# EAGLE schematic PIO-Dev-3 (EAGLE 9.5.2)
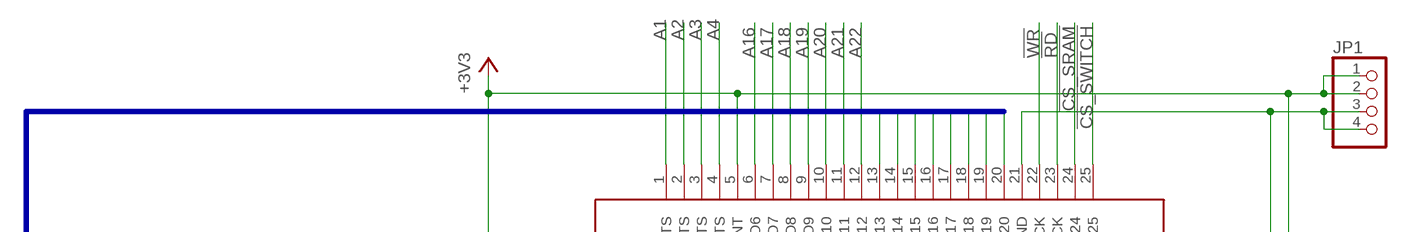
[diagram p0: schematic, sheet 1, part 1 of 3]
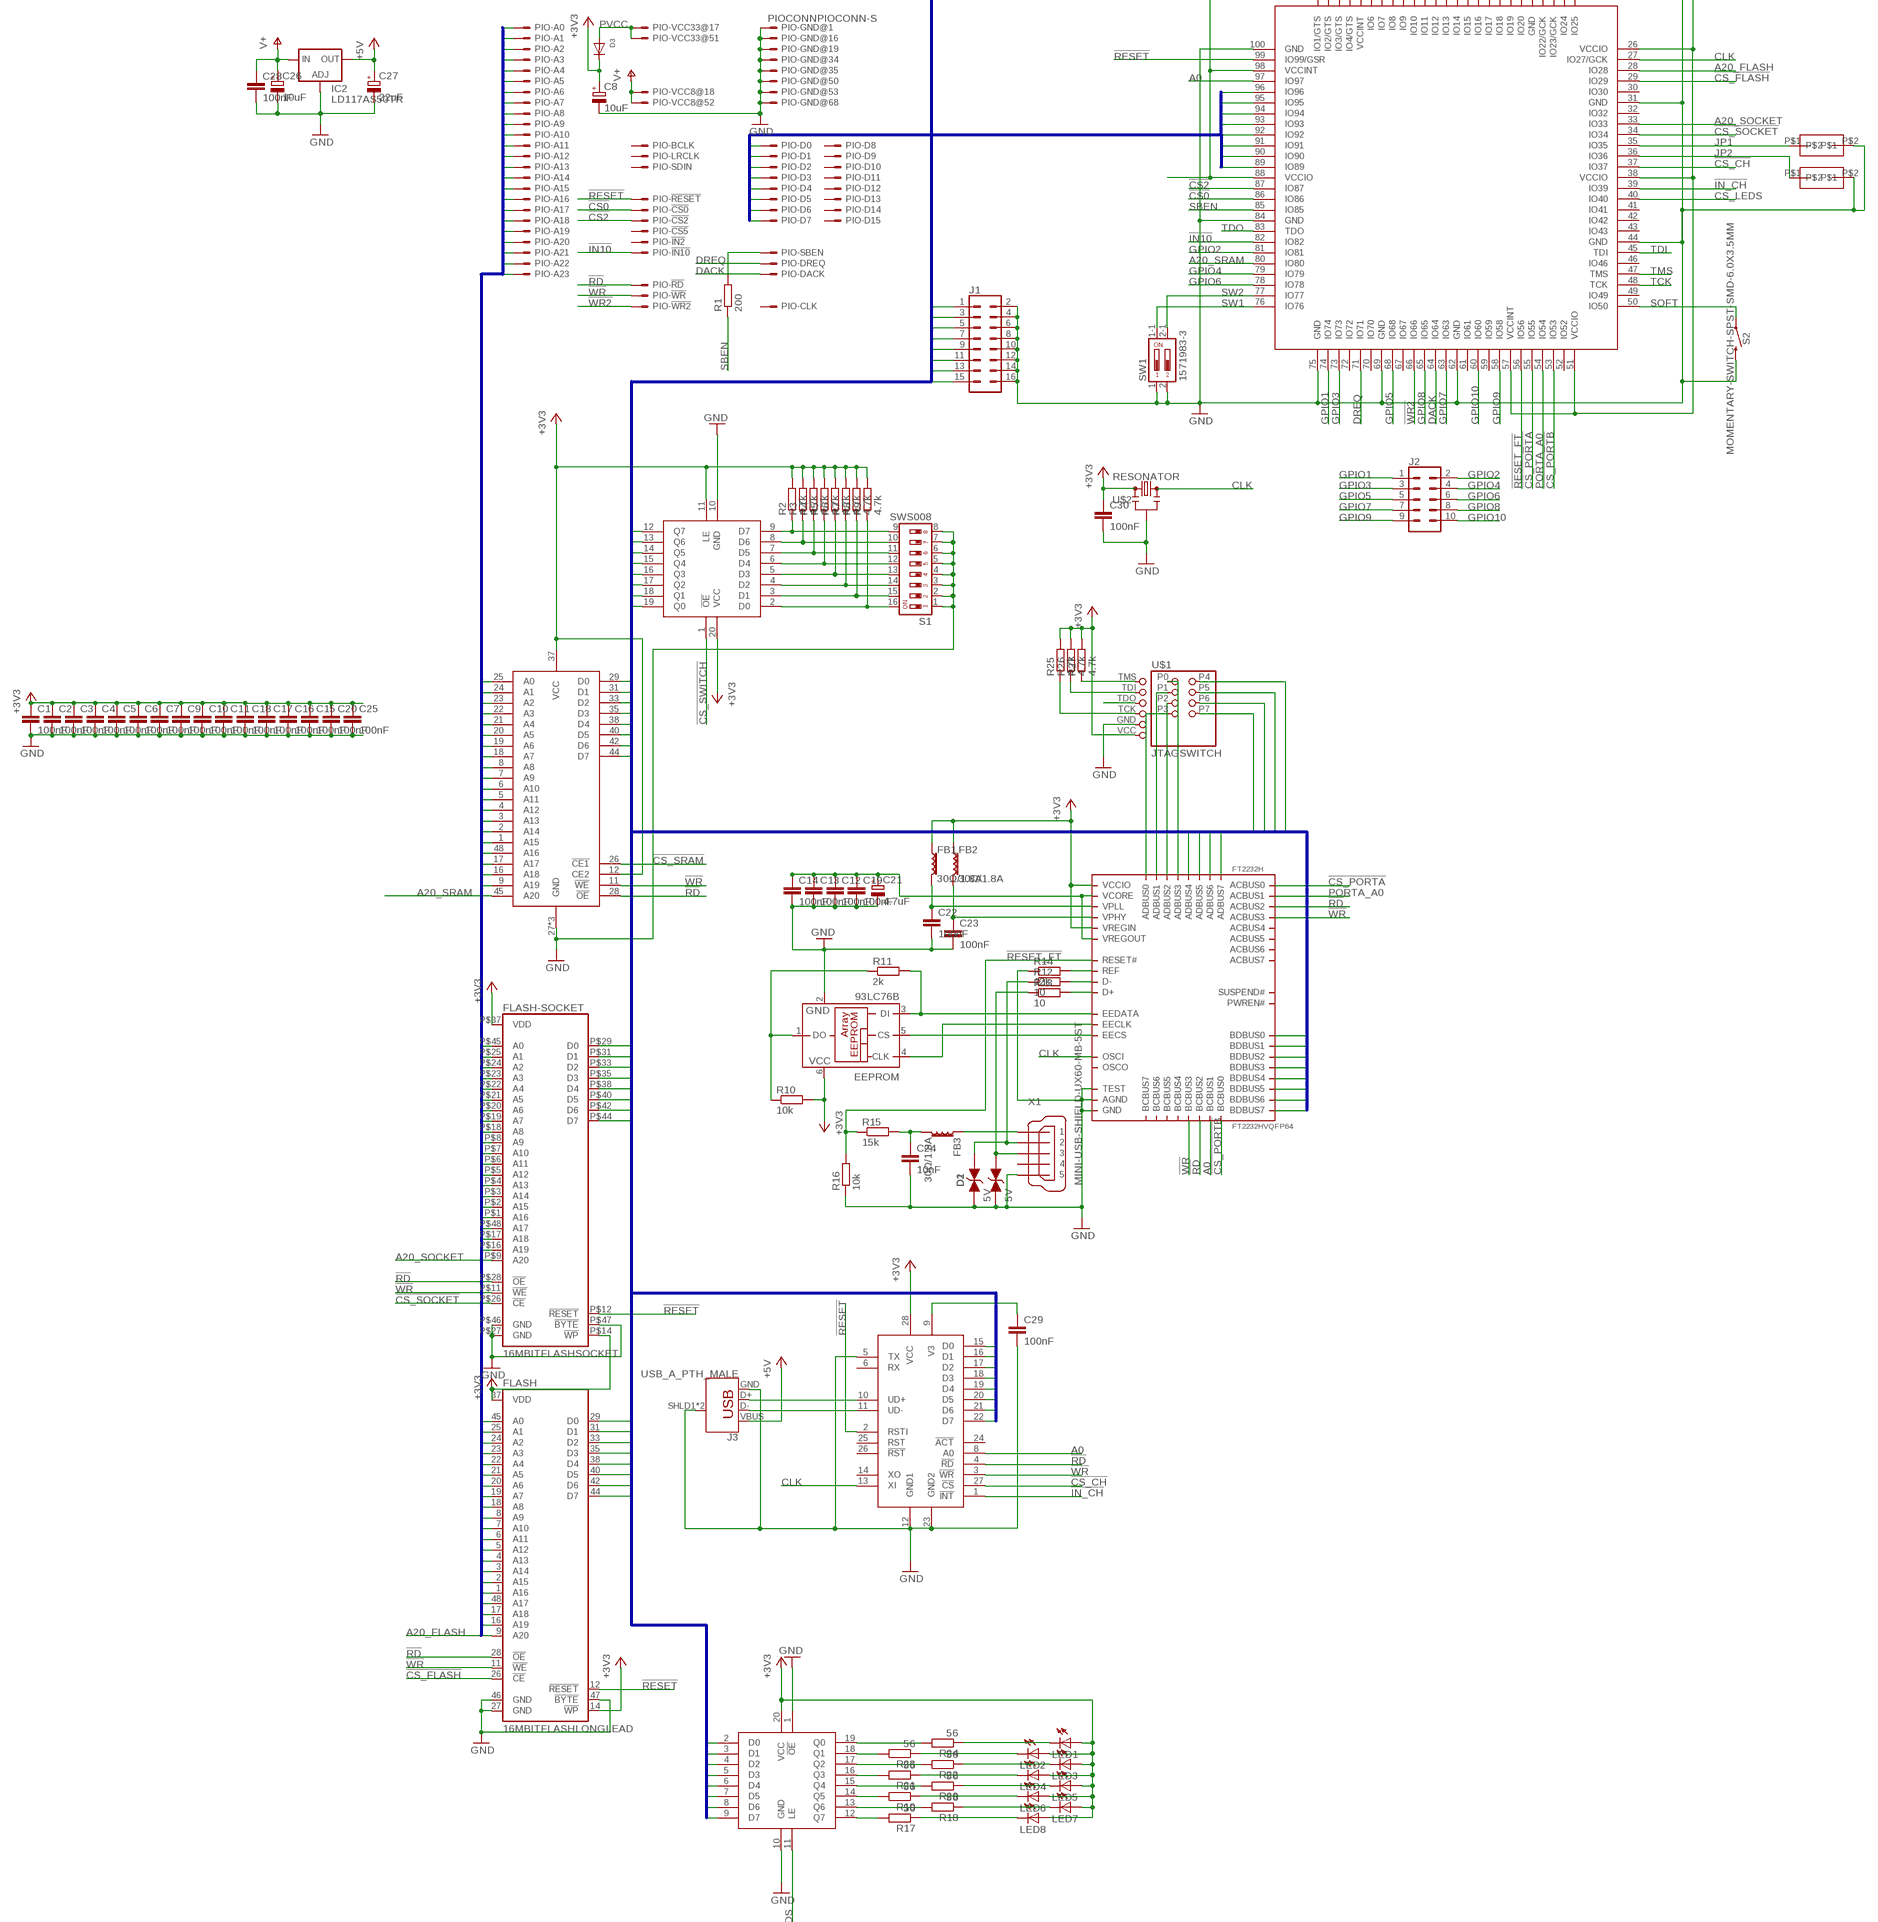
[diagram p1: schematic, sheet 1, part 2 of 3]
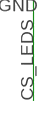
[diagram p2: schematic, sheet 1, part 3 of 3]

## Parts
C1  100nF  C-EUC0402K  [C0402K]
C2  100nF  C-EUC0402K  [C0402K]
C3  100nF  C-EUC0402K  [C0402K]
C4  100nF  C-EUC0402K  [C0402K]
C5  100nF  C-EUC0402K  [C0402K]
C6  100nF  C-EUC0402K  [C0402K]
C7  100nF  C-EUC0402K  [C0402K]
C8  10uF  CPOL-EUA/3216-18W  [A/3216-18W]
C9  100nF  C-EUC0402K  [C0402K]
C10  100nF  C-EUC0402K  [C0402K]
C11  100nF  C-EUC0402K  [C0402K]
C12  100nF  C-EUC0603K  [C0603K]
C13  100nF  C-EUC0603K  [C0603K]
C14  100nF  C-EUC0603K  [C0603K]
C15  100nF  C-EUC0603K  [C0603K]
C16  100nF  C-EUC0603K  [C0603K]
C17  100nF  C-EUC0603K  [C0603K]
C18  100nF  C-EUC0603K  [C0603K]
C19  100nF  C-EUC0603K  [C0603K]
C20  100nF  C-EUC0603K  [C0603K]
C21  4.7uF  CPOL-EUA/3216-18W  [A/3216-18W]
C22  100nF  C-EUC0603K  [C0603K]
C23  100nF  C-EUC0603K  [C0603K]
C24  10nF  C-EUC0402K  [C0402K]
C25  100nF  C-EUC0402K  [C0402K]
C26  10uF  CPOL-EUA/3216-18W  [A/3216-18W]
C27  22uF  CPOL-EUA/3216-18W  [A/3216-18W]
C28  100nF  C-EUC0603K  [C0603K]
C29  100nF  C-EUC0402K  [C0402K]
C30  100nF  C-EUC0603K  [C0603K]
CH  CH375B  [SOP28-LL]
CPLD  XC95144XL-100  [TQFP100]
D1  5V  WE-VE_0603_82356050050  [WE-VE_0603]
D2  5V  WE-VE_0603_82356050050  [WE-VE_0603]
D3  DIODESOD-123  [SOD-123]
EEPROM  93LC76B  [SOT23-6]
FB1  30Ω/1.8A  FERRITE_BEAD-0603  [0603]
FB2  30Ω/1.8A  FERRITE_BEAD-0603  [0603]
FB3  30Ω/1.8A  FERRITE_BEAD-0603  [0603]
FLASH  16MBITFLASHLONGLEAD  [TSOP48-LL]
FLASH-SOCKET  16MBITFLASHSOCKET  [TSOP48-ADAPTER]
FT2232H  FT2232HVQFP64  [VQFP64]
IC2  LD117AS50TR  [SOT223]
J1  CONN_08X2SHD_SMD  [2X8-SHROUDED_SMD]
J2  CONN_05X2SHD_SMD  [2X5-SHROUDED_SMD]
J3  USB_A_PTH_MALE  [USB-A-H]
JP1  PINHD-1X4  [1X04]
LED1  LEDCHIPLED_1206  [CHIPLED_1206]
LED2  LEDCHIPLED_1206  [CHIPLED_1206]
LED3  LEDCHIPLED_1206  [CHIPLED_1206]
LED4  LEDCHIPLED_1206  [CHIPLED_1206]
LED5  LEDCHIPLED_1206  [CHIPLED_1206]
LED6  LEDCHIPLED_1206  [CHIPLED_1206]
LED7  LEDCHIPLED_1206  [CHIPLED_1206]
LED8  LEDCHIPLED_1206  [CHIPLED_1206]
LEDS  74LVC573APW  [TSSOP20-LL]
PIO  PIOCONNPIOCONN-S  [PIOCONN]
R1  200  R-EU_R0402  [R0402]
R2  4.7k  R-EU_R0402  [R0402]
R3  4.7k  R-EU_R0402  [R0402]
R4  4.7k  R-EU_R0402  [R0402]
R5  4.7k  R-EU_R0402  [R0402]
R6  4.7k  R-EU_R0402  [R0402]
R7  4.7k  R-EU_R0402  [R0402]
R8  4.7k  R-EU_R0402  [R0402]
R9  4.7k  R-EU_R0402  [R0402]
R10  10k  R-EU_R0402  [R0402]
R11  2k  R-EU_R0402  [R0402]
R12  10  R-EU_R0402  [R0402]
R13  10  R-EU_R0402  [R0402]
R14  12k  R-EU_R0402  [R0402]
R15  15k  R-EU_R0402  [R0402]
R16  10k  R-EU_R0402  [R0402]
R17  56  R-EU_R0603  [R0603]
R18  56  R-EU_R0603  [R0603]
R19  56  R-EU_R0603  [R0603]
R20  56  R-EU_R0603  [R0603]
R21  56  R-EU_R0603  [R0603]
R22  56  R-EU_R0603  [R0603]
R23  56  R-EU_R0603  [R0603]
R24  56  R-EU_R0603  [R0603]
R25  4.7k  R-EU_R0402  [R0402]
R26  4.7k  R-EU_R0402  [R0402]
R27  4.7k  R-EU_R0402  [R0402]
S1  SWS008  [SMS-008]
S2  MOMENTARY-SWITCH-SPST-SMD-6.0X3.5MM  [TACTILE_SWITCH_SMD_6.0X3.5MM]
SRAM  CY62167EV30LL  [TSOP48-LL]
SW1  1571983-3  [1571983-3]
SWITCH  74LVC573APW  [TSSOP20-LL]
U$1  JTAGSWITCH  [JTAGSWITCH]
U$2  RESONATOR  [RESONATOR]
U$3  SMD-JUMPER  [SMD-JUMPER]
U$4  SMD-JUMPER  [SMD-JUMPER]
X1  MINI-USB-SHIELD-UX60-MB-5ST  [UX60-MB-5ST]

## Nets
!CS0: CPLD.86(IO86) PIO.4
!CS2: CPLD.87(IO87) PIO.39
!CS_CH: CH.27(!CS) CPLD.37(IO37)
!CS_FLASH: CPLD.29(IO29) FLASH.26(!CE)
!CS_PORTA: CPLD.55(IO55) FT2232H.26(ACBUS0)
!CS_PORTB: CPLD.53(IO53) FT2232H.48(BCBUS0)
!CS_SOCKET: CPLD.34(IO34) FLASH-SOCKET.P$26(!CE)
!CS_SRAM: CPLD.24(IO24) SRAM.26(!CE1)
!CS_SWITCH: CPLD.25(IO25) SWITCH.1(!OE)
!IN10: CPLD.82(IO82) PIO.37
!IN_CH: CH.1(!INT) CPLD.39(IO39)
!RD: CH.4(!RD) CPLD.23(IO23/GCK) FLASH-SOCKET.P$28(!OE) FLASH.28(!OE) FT2232H.28(ACBUS2) FT2232H.53(BCBUS2) PIO.30 SRAM.28(!OE)
!RESET: CH.2(RSTI) CPLD.99(IO99/GSR) FLASH-SOCKET.P$12(!RESET) FLASH.12(!RESET) PIO.2
!RESET_FT: CPLD.56(IO56) FT2232H.14(RESET#) R15.1 R16.2
!WR: CH.3(!WR) CPLD.22(IO22/GCK) FLASH-SOCKET.P$11(!WE) FLASH.11(!WE) FT2232H.29(ACBUS3) FT2232H.54(BCBUS3) PIO.64 SRAM.11(!WE)
!WR2: CPLD.66(IO66) PIO.38
+3V3: C1.1 C2.1 C3.1 C4.1 C5.1 C6.1 C7.1 C8.+ C9.1 C10.1 C11.1 C15.1 C16.1 C17.1 C18.1 C20.1 C25.1 C30.1 CH.28(VCC) CPLD.5(VCCINT) CPLD.26(VCCIO) CPLD.38(VCCIO) CPLD.51(VCCIO) CPLD.57(VCCINT) CPLD.88(VCCIO) CPLD.98(VCCINT) D3.C EEPROM.6(VCC) FB1.1 FB2.1 FLASH-SOCKET.P$14(!WP) FLASH-SOCKET.P$37(VDD) FLASH.14(!WP) FLASH.37(VDD) FT2232H.20(VCCIO) FT2232H.31(VCCIO) FT2232H.42(VCCIO) FT2232H.50(VREGIN) FT2232H.56(VCCIO) JP1.1 JP1.2 LED1.A LED2.A LED3.A LED4.A LED5.A LED6.A LED7.A LED8.A LEDS.20(VCC) R2.2 R3.2 R4.2 R5.2 R6.2 R7.2 R8.2 R9.2 R10.2 R25.2 R26.2 R27.2 SRAM.12(CE2) SRAM.37(VCC) SWITCH.11(LE) SWITCH.20(VCC) U$1.VCC U$2.P4(VDD)
+5V: C27.+ IC2.4(OUT) J3.VBUS
A0: CH.8(A0) CPLD.97(IO97) FLASH-SOCKET.P$45(A0) FLASH.45(A0) FT2232H.52(BCBUS1) PIO.14 SRAM.25(A0)
A1: CPLD.1(IO1/GTS) FLASH-SOCKET.P$25(A1) FLASH.25(A1) PIO.48 SRAM.24(A1)
A2: CPLD.2(IO2/GTS) FLASH-SOCKET.P$24(A2) FLASH.24(A2) PIO.15 SRAM.23(A2)
A3: CPLD.3(IO3/GTS) FLASH-SOCKET.P$23(A3) FLASH.23(A3) PIO.49 SRAM.22(A3)
A4: CPLD.4(IO4/GTS) FLASH-SOCKET.P$22(A4) FLASH.22(A4) PIO.20 SRAM.21(A4)
A5: FLASH-SOCKET.P$21(A5) FLASH.21(A5) PIO.54 SRAM.20(A5)
A6: FLASH-SOCKET.P$20(A6) FLASH.20(A6) PIO.21 SRAM.19(A6)
A7: FLASH-SOCKET.P$19(A7) FLASH.19(A7) PIO.55 SRAM.18(A7)
A8: FLASH-SOCKET.P$18(A8) FLASH.18(A8) PIO.22 SRAM.8(A8)
A9: FLASH-SOCKET.P$8(A9) FLASH.8(A9) PIO.56 SRAM.7(A9)
A10: FLASH-SOCKET.P$7(A10) FLASH.7(A10) PIO.23 SRAM.6(A10)
A11: FLASH-SOCKET.P$6(A11) FLASH.6(A11) PIO.57 SRAM.5(A11)
A12: FLASH-SOCKET.P$5(A12) FLASH.5(A12) PIO.24 SRAM.4(A12)
A13: FLASH-SOCKET.P$4(A13) FLASH.4(A13) PIO.58 SRAM.3(A13)
A14: FLASH-SOCKET.P$3(A14) FLASH.3(A14) PIO.25 SRAM.2(A14)
A15: FLASH-SOCKET.P$2(A15) FLASH.2(A15) PIO.59 SRAM.1(A15)
A16: CPLD.6(IO6) FLASH-SOCKET.P$1(A16) FLASH.1(A16) PIO.26 SRAM.48(A16)
A17: CPLD.7(IO7) FLASH-SOCKET.P$48(A17) FLASH.48(A17) PIO.60 SRAM.17(A17)
A18: CPLD.8(IO8) FLASH-SOCKET.P$17(A18) FLASH.17(A18) PIO.27 SRAM.16(A18)
A19: CPLD.9(IO9) FLASH-SOCKET.P$16(A19) FLASH.16(A19) PIO.61 SRAM.9(A19)
A20: CPLD.10(IO10) PIO.28
A20_FLASH: CPLD.28(IO28) FLASH.9(A20)
A20_SOCKET: CPLD.33(IO33) FLASH-SOCKET.P$9(A20)
A20_SRAM: CPLD.80(IO80) SRAM.45(A20)
A21: CPLD.11(IO11) PIO.62
A22: CPLD.12(IO12) PIO.29
A23: PIO.63
AD0: FT2232H.16(ADBUS0) U$1.P3
AD1: FT2232H.17(ADBUS1) U$1.P1
AD2: FT2232H.18(ADBUS2) U$1.P2
AD3: FT2232H.19(ADBUS3) U$1.P0
CDM: CH.11(UD-) J3.D-
CDP: CH.10(UD+) J3.D+
CLK: CH.13(XI) CPLD.27(IO27/GCK) FT2232H.2(OSCI) U$2.P3(OUTPUT)
CS_LEDS: CPLD.40(IO40) LEDS.11(LE)
D0: CH.15(D0) CPLD.20(IO20) FLASH-SOCKET.P$29(D0) FLASH.29(D0) FT2232H.38(BDBUS0) J1.15 LEDS.2(D0) SRAM.29(D0) SWITCH.12(Q7) U$1.P4
D1: CH.16(D1) CPLD.19(IO19) FLASH-SOCKET.P$31(D1) FLASH.31(D1) FT2232H.39(BDBUS1) J1.13 LEDS.3(D1) SRAM.31(D1) SWITCH.13(Q6) U$1.P6
D2: CH.17(D2) CPLD.18(IO18) FLASH-SOCKET.P$33(D2) FLASH.33(D2) FT2232H.40(BDBUS2) J1.11 LEDS.4(D2) SRAM.33(D2) SWITCH.14(Q5) U$1.P5
D3: CH.18(D3) CPLD.17(IO17) FLASH-SOCKET.P$35(D3) FLASH.35(D3) FT2232H.41(BDBUS3) J1.9 LEDS.5(D3) SRAM.35(D3) SWITCH.15(Q4) U$1.P7
D4: CH.19(D4) CPLD.16(IO16) FLASH-SOCKET.P$38(D4) FLASH.38(D4) FT2232H.21(ADBUS4) FT2232H.43(BDBUS4) J1.7 LEDS.6(D4) SRAM.38(D4) SWITCH.16(Q3)
D5: CH.20(D5) CPLD.15(IO15) FLASH-SOCKET.P$40(D5) FLASH.40(D5) FT2232H.22(ADBUS5) FT2232H.44(BDBUS5) J1.5 LEDS.7(D5) SRAM.40(D5) SWITCH.17(Q2)
D6: CH.21(D6) CPLD.14(IO14) FLASH-SOCKET.P$42(D6) FLASH.42(D6) FT2232H.23(ADBUS6) FT2232H.45(BDBUS6) J1.3 LEDS.8(D6) SRAM.42(D6) SWITCH.18(Q1)
D7: CH.22(D7) CPLD.13(IO13) FLASH-SOCKET.P$44(D7) FLASH.44(D7) FT2232H.24(ADBUS7) FT2232H.46(BDBUS7) J1.1 LEDS.9(D7) SRAM.44(D7) SWITCH.19(Q0)
DACK: CPLD.64(IO64) PIO.36
DM: D2.1 R12.1 X1.2
DP: D1.1 R13.1 X1.3
DREQ: CPLD.71(IO71) PIO.3
EECLK: EEPROM.4(CLK) FT2232H.62(EECLK)
EECS: EEPROM.5(CS) FT2232H.63(EECS)
EEDATA: EEPROM.3(DI) FT2232H.61(EEDATA) R11.2
EEDO: EEPROM.1(DO) R10.1 R11.1
FDM: FT2232H.7(D-) R12.2
FDP: FT2232H.8(D+) R13.2
GND: C1.2 C2.2 C3.2 C4.2 C5.2 C6.2 C7.2 C8.- C9.2 C10.2 C11.2 C12.2 C13.2 C14.2 C15.2 C16.2 C17.2 C18.2 C19.2 C20.2 C21.- C22.2 C23.2 C24.2 C25.2 C26.- C27.- C28.2 C29.2 C30.2 CH.5(TX) CH.12(GND1) CH.23(GND2) CPLD.21(GND) CPLD.31(GND) CPLD.44(GND) CPLD.62(GND) CPLD.69(GND) CPLD.75(GND) CPLD.84(GND) CPLD.100(GND) D1.2 D2.2 EEPROM.2(GND) FLASH-SOCKET.P$27(GND) FLASH-SOCKET.P$46(GND) FLASH-SOCKET.P$47(!BYTE) FLASH.27(GND) FLASH.46(GND) FLASH.47(!BYTE) FT2232H.1(GND) FT2232H.5(GND) FT2232H.10(AGND) FT2232H.11(GND) FT2232H.13(TEST) FT2232H.15(GND) FT2232H.25(GND) FT2232H.35(GND) FT2232H.47(GND) FT2232H.51(GND) IC2.1(ADJ) J1.2 J1.4 J1.6 J1.8 J1.10 J1.12 J1.14 J1.16 J3.GND J3.SHLD1(SHIELD) J3.SHLD2(SHIELD) JP1.3 JP1.4 LEDS.1(!OE) LEDS.10(GND) PIO.1 PIO.16 PIO.19 PIO.34 PIO.35 PIO.50 PIO.53 PIO.68 R14.1 R16.1 S1.1 S1.2 S1.3 S1.4 S1.5 S1.6 S1.7 S1.8 S2.2 SRAM.27(GND) SRAM.46(GND) SRAM.47(GND) SW1.1 SW1.2 SWITCH.10(GND) U$1.GND U$2.P2(GND) U$3.P$2 U$4.P$2 X1.5
GPIO1: CPLD.74(IO74) J2.1
GPIO2: CPLD.81(IO81) J2.2
GPIO3: CPLD.73(IO73) J2.3
GPIO4: CPLD.79(IO79) J2.4
GPIO5: CPLD.68(IO68) J2.5
GPIO6: CPLD.78(IO78) J2.6
GPIO7: CPLD.63(IO63) J2.7
GPIO8: CPLD.65(IO65) J2.8
GPIO9: CPLD.58(IO58) J2.9
GPIO10: CPLD.60(IO60) J2.10
JP1: CPLD.35(IO35) U$3.P$1
JP2: CPLD.36(IO36) U$4.P$1
L0: LEDS.19(Q0) R24.2
L1: LEDS.18(Q1) R23.2
L2: LEDS.17(Q2) R22.2
L3: LEDS.16(Q3) R21.2
L4: LEDS.15(Q4) R20.2
L5: LEDS.14(Q5) R19.2
L6: LEDS.13(Q6) R18.2
L7: LEDS.12(Q7) R17.2
LP0: LED1.C R24.1
LP1: LED2.C R23.1
LP2: LED3.C R22.1
LP3: LED4.C R21.1
LP4: LED5.C R20.1
LP5: LED6.C R19.1
LP6: LED7.C R18.1
LP7: LED8.C R17.1
PD0: CPLD.89(IO89) PIO.6
PD1: CPLD.90(IO90) PIO.40
PD2: CPLD.91(IO91) PIO.7
PD3: CPLD.92(IO92) PIO.41
PD4: CPLD.93(IO93) PIO.8
PD5: CPLD.94(IO94) PIO.42
PD6: CPLD.95(IO95) PIO.9
PD7: CPLD.96(IO96) PIO.43
PORTA_A0: CPLD.54(IO54) FT2232H.27(ACBUS1)
PSBEN: PIO.5 R1.2
PVCC: D3.A PIO.17 PIO.51
REF: FT2232H.6(REF) R14.2
S0: R2.1 S1.9 SWITCH.9(D7)
S1: R3.1 S1.10 SWITCH.8(D6)
S2: R4.1 S1.11 SWITCH.7(D5)
S3: R5.1 S1.12 SWITCH.6(D4)
S4: R6.1 S1.13 SWITCH.5(D3)
S5: R7.1 S1.14 SWITCH.4(D2)
S6: R8.1 S1.15 SWITCH.3(D1)
S7: R9.1 S1.16 SWITCH.2(D0)
SBEN: CPLD.85(IO85) R1.1
SOFT: CPLD.50(IO50) S2.1
SW1: CPLD.76(IO76) SW1.1-1
SW2: CPLD.77(IO77) SW1.2-1
TCK: CPLD.48(TCK) R25.1 U$1.TCK
TDI: CPLD.45(TDI) R26.1 U$1.TDI
TDO: CPLD.83(TDO) U$1.TDO
TMS: CPLD.47(TMS) R27.1 U$1.TMS
V3: C29.1 CH.9(V3)
V+: C26.+ C28.1 IC2.3(IN) PIO.18 PIO.52
VBUS: FB3.1 X1.1
VBUSQUIET: C24.1 FB3.2 R15.2
VCORE: C12.1 C13.1 C14.1 C19.1 C21.+ FT2232H.12(VCORE) FT2232H.37(VCORE) FT2232H.49(VREGOUT) FT2232H.64(VCORE)
VPHY: C23.1 FB2.2 FT2232H.4(VPHY)
VPLL: C22.1 FB1.2 FT2232H.9(VPLL)
Unconnected: CH.6(RX) CH.14(XO) CH.24(!ACT) CH.25(RST) CH.26(!RST) CPLD.30(IO30) CPLD.32(IO32) CPLD.41(IO41) CPLD.42(IO42) CPLD.43(IO43) CPLD.46(IO46) CPLD.49(IO49) CPLD.52(IO52) CPLD.59(IO59) CPLD.61(IO61) CPLD.67(IO67) CPLD.70(IO70) CPLD.72(IO72) FT2232H.3(OSCO) FT2232H.30(ACBUS4) FT2232H.32(ACBUS5) FT2232H.33(ACBUS6) FT2232H.34(ACBUS7) FT2232H.36(SUSPEND#) FT2232H.55(BCBUS4) FT2232H.57(BCBUS5) FT2232H.58(BCBUS6) FT2232H.59(BCBUS7) FT2232H.60(PWREN#) PIO.10 PIO.11 PIO.12 PIO.13 PIO.31 PIO.32 PIO.33 PIO.44 PIO.45 PIO.46 PIO.47 PIO.65 PIO.66 PIO.67 X1.4 X1.M1(S1) X1.M2(S2) X1.M3(S3) X1.M4(S4)

## Buses
A0,A1,A2,A3,A4,A5,A6,A7,A8,A9,A10,A11,A12,A13,A14,A15,A16,A17,A18,A19,A20,A21,A22,A23
PD0,PD1,PD2,PD3,PD4,PD5,PD6,PD7
D0,D1,D2,D3,D4,D5,D6,D7

## Library data of the parts
C1-C7 C9-C20 C22-C25 C28-C30 = rcl:C-EU: CAPACITOR, European symbol; SPICEPREFIX: C
C8 C21 C26 C27 = rcl:CPOL-EU: POLARIZED CAPACITOR, European symbol; SPICEPREFIX: C
CH = pixel:CH375B
CPLD = pixel:XC95144XL-100
D1 D2 = Wurth_EMC Components_WE-VE:WE-VE_0603: WE-VE ESD Suppressor Characteristics Fast response time No leakage current Low clamping voltage Almost no energy consumption in stand-by mode Excellent absorption for ESD-impulses Operating temperature: –40 ºC to +85 ºC Nickel barrier Applications Protection of data lines Protection of bus systems Protection of semiconductors ESD protection in accordance with EN 61000-4-2: – 8 kV contact discharge – 15 kV air discharge <https://katalog.we-online.de/media/images/v2/o14891v209%20Family_WE-VE.jpg> Details see: https://katalog.we-online.de/en/pbs/WE-VE Updated by Ella Wu 2019-07-04 2019 (C) Wurth Elektronik; DATASHEET-URL: https://katalog.we-online.de/pbs/datasheet/82356050050.pdf; ILEAK: 1uA; MOUNT: SMT; PART-NUMBER: 82356050050; RISO: 10 MOhm; VCLAMP-TYP: 75V; VESD-AIR: 15kV
D3 = adafruit:DIODE: Diode SMADIODE - SMA Surface Mount Package 20V 1A Schottky Diode Digikey: 641-1014-6-ND DO-1N4148 - Through Hole Small Current Diode SOD-123 20V 1 A (.5mV Vf) Schottky Diode - Digikey: MBRX120TPMSCT-ND SOD-323 10V 570mA (.38mV Vf, 3ns) Schottky Diode - Digikey: ZLLS410CT-ND SOD-523 30V 30mA Schottky Diode (RB751S-40TE61) - Digikey: RB751S-40TE61CT-ND SOT23-R/W - SOT23 Package (R = Solder Paste/Reflow Ovens, W = Hand-Soldering) BAT54Film 40V 300mA - Digikey: 497-7162-1-ND
EEPROM = microchip:93*76?: 8K Microwire Compatible Serial EEPROM Source: http://ww1.microchip.com/downloads/en/DeviceDoc/21796H.pdf; MF: MICROCHIP; MPN: 93LC76BT-I/OT; OC_FARNELL: 1556170; OC_NEWARK: 61H6848
FB1-FB3 = SparkFun-Coils:FERRITE_BEAD: Ferrite Bead (blocks, cores, rings, chokes, etc.) Inductor with layers of ferrite used to suppress high frequencies. Often used to isolate high frequency noise. SparkFun Products: IOIO-OTG - V2.2 <https://www.sparkfun.com/products/13613> SparkFun SAMD21 Mini Breakout <https://www.sparkfun.com/products/13664> SparkFun 6 Degrees of Freedom Breakout - LSM6DS3 <https://www.sparkfun.com/products/13339> SparkFun SAMD21 Dev Breakout <https://www.sparkfun.com/products/13672>; PROD_ID: NDUC-07859
FLASH FLASH-SOCKET = pixel:16MBITFLASH
FT2232H = pixel:FT2232H
IC2 = v-reg:LD117A?*: Low drop fixed and adjustable positive voltage regulators 1 A Source: http://www.st.com/stonline/products/literature/ds/7194/ld1117axx.pdf
J1 = pixel:CONN_08X2: Multi connection point. Often used as Generic Header-pin footprint for 0.1 inch spaced/style header connections For AVR SPI programming port, see special device with nice symbol: "AVR_SPI_PROG_5x2.dev" You can populate with any combo of single row headers, but if you'd like an exact match, check these: 2x5 AVR ICSP Male Header <https://www.sparkfun.com/products/778> (PRT-00778) 2x5 Pin Shrouded Header <https://www.sparkfun.com/products/8506> (PRT-08506) On any of the 0.1 inch spaced packages, you can populate with these: Break Away Headers - Straight <https://www.sparkfun.com/products/116> (PRT-00116) Break Away Male Headers - Right Angle <https://www.sparkfun.com/products/553> (PRT-00553) Female Headers <https://www.sparkfun.com/products/115> (PRT-00115) Break Away Headers - Machine Pin <https://www.sparkfun.com/products/117> (PRT-00117) Break Away Female Headers - Swiss Machine Pin <https://www.sparkfun.com/products/743> (PRT-00743) Special note: the shrouded connector mates well with our 5x2 ribbon cables: 2x5 Pin IDC Ribbon Cable <https://www.sparkfun.com/products/8535> (PRT-08535); PROD_ID: CONN-09508
J2 = SparkFun-Connectors:CONN_05X2: Multi connection point. Often used as Generic Header-pin footprint for 0.1 inch spaced/style header connections For AVR SPI programming port, see special device with nice symbol: "AVR_SPI_PROG_5x2.dev" You can populate with any combo of single row headers, but if you'd like an exact match, check these: 2x5 AVR ICSP Male Header <https://www.sparkfun.com/products/778> (PRT-00778) 2x5 Pin Shrouded Header <https://www.sparkfun.com/products/8506> (PRT-08506) On any of the 0.1 inch spaced packages, you can populate with these: Break Away Headers - Straight <https://www.sparkfun.com/products/116> (PRT-00116) Break Away Male Headers - Right Angle <https://www.sparkfun.com/products/553> (PRT-00553) Female Headers <https://www.sparkfun.com/products/115> (PRT-00115) Break Away Headers - Machine Pin <https://www.sparkfun.com/products/117> (PRT-00117) Break Away Female Headers - Swiss Machine Pin <https://www.sparkfun.com/products/743> (PRT-00743) Special note: the shrouded connector mates well with our 5x2 ribbon cables: 2x5 Pin IDC Ribbon Cable <https://www.sparkfun.com/products/8535> (PRT-08535); PROD_ID: CONN-09508
J3 = SparkFun-Connectors:USB_A: USB-A Connector Male and female variants, as well as PTH and SMT variants SparkFun Products: SparkFun XBee Explorer Dongle <https://www.sparkfun.com/products/11697> PTH Male SparkFun MicroView-USB Programmer <https://www.sparkfun.com/products/12924> SMT Male SparkFun USB Type A Female Breakout <https://www.sparkfun.com/products/12700> SMT Female; PROD_ID: CONN-08367; SF_ID: PRT-00437
JP1 = pinhead:PINHD-1X4: PIN HEADER
LED1-LED8 = adafruit:LED: LED OSRAM: - CHIPLED LG R971, LG N971, LY N971, LG Q971, LY Q971, LO R971, LY R971 LH N974, LH R974 LS Q976, LO Q976, LY Q976 LO Q996 - Hyper CHIPLED LW Q18S LB Q993, LB Q99A, LB R99A - SideLED LS A670, LO A670, LY A670, LG A670, LP A670 LB A673, LV A673, LT A673, LW A673 LH A674 LY A675 LS A676, LA A676, LO A676, LY A676, LW A676 LS A679, LY A679, LG A679 - Hyper Micro SIDELED® LS Y876, LA Y876, LO Y876, LY Y876 LT Y87S - SmartLED LW L88C, LW L88S LB L89C, LB L89S, LG L890 LS L89K, LO L89K, LY L89K LS L896, LA L896, LO L896, LY L896 - TOPLED LS T670, LO T670, LY T670, LG T670, LP T670 LSG T670, LSP T670, LSY T670, LOP T670, LYG T670 LG T671, LOG T671, LSG T671 LB T673, LV T673, LT T673, LW T673 LH T674 LS T676, LA T676, LO T676, LY T676, LB T676, LH T676, LSB T676, LW T676 LB T67C, LV T67C, LT T67C, LS T67K, LO T67K, LY T67K, LW E67C LS E67B, LA E67B, LO E67B, LY E67B, LB E67C, LV E67C, LT E67C LW T67C LS T679, LY T679, LG T679 LS T770, LO T770, LY T770, LG T770, LP T770 LB T773, LV T773, LT T773, LW T773 LH T774 LS E675, LA E675, LY E675, LS T675 LS T776, LA T776, LO T776, LY T776, LB T776 LHGB T686 LT T68C, LB T68C - Hyper Mini TOPLED® LB M676 - Mini TOPLED Santana® LG M470 LS M47K, LO M47K, LY M47K Source: http://www.osram.convergy.de/
LEDS SWITCH = pixel:74LVC573APW
PIO = pixel:PIOCONN: CONNECTOR 68-pin 1.27mm (.050 inch) pitch SCSI+ unshielded receptacle right angle all plastic
R1-R27 = rcl:R-EU_: RESISTOR, European symbol; SPICEPREFIX: R
S1 = smd-special:SWS008: SMD Dip Switch 8 pol.
S2 = SparkFun-Switches:MOMENTARY-SWITCH-SPST: Momentary Switch (Pushbutton) - SPST Normally-open (NO) SPST momentary switches (buttons, pushbuttons). Variants PTH-12MM - 12mm square, through-hole Momentary Pushbutton Switch - 12mm Square <https://www.sparkfun.com/products/9190> (COM-09190) PTH-6.0MM, PTH-6.0MM-KIT - 6.0mm square, through-hole Mini Pushbutton Switch <https://www.sparkfun.com/products/97> (COM-00097) KIT package intended for soldering kit's - only one side of pads' copper is exposed. PTH-RIGHT-ANGLE-KIT - Right-angle, through-hole Right Angle Tactile Button <https://www.sparkfun.com/products/10791> - Used on SparkFun BigTime Watch Kit <https://www.sparkfun.com/products/11734> SMD-12MM - 12mm square, surface-mount Tactile Button - SMD (12mm) <https://www.sparkfun.com/products/12993> (COM-12993) Used on SparkFun PicoBoard <https://www.sparkfun.com/products/11888> SMD-4.5MM - 4.5mm Square Trackball Switch Used on SparkFun Blackberry Trackballer Breakout <https://www.sparkfun.com/products/13169> SMD-4.6MMX2.8MM - 4.60mm x 2.80mm, surface mount Used on SparkFun SAMD21 Mini Breakout <https://www.sparkfun.com/products/13664> SMD-5.2MM, SMD-5.2-REDUNDANT - 5.2mm square, surface-mount Mini Pushbutton Switch - SMD <https://www.sparkfun.com/products/8720> (COM-08720) Used on Arduino Pro Mini <https://www.sparkfun.com/products/11114> REDUNDANT package connects both switch circuits together SMD-6.0X3.5MM - 6.0 x 3.5mm, surface mount Momentary Reset Switch SMD <https://www.sparkfun.com/products/8229> (COM-08229) SMD-6.2MM-TALL - 6.2mm square, surface mount Tactile Button - SMD (6mm) <https://www.sparkfun.com/products/12992> Used on SparkFun Digital Sandbox <https://www.sparkfun.com/products/12651> SMD-RIGHT-ANGLE - Right-angle, surface mount Used on SparkFun Block for Intel® Edison - Arduino <https://www.sparkfun.com/products/13036>; PROD_ID: SWCH-00815; SF_SKU: COM-08229
SRAM = pixel:CY62167EV30
SW1 = Switch:1571983-3: SWITCH SLIDE DIP SPST 25MA 24V Manufacturer's datasheet <https://www.te.com/commerce/DocumentDelivery/DDEController?Action=srchrtrv&DocNm=1571983&DocType=Customer+Drawing&DocLang=English>; CREATED_BY: PCBLayout.com; DIGIKEY_PARTNO: 450-2128-2-ND; MANUFACTURER: TE Connectivity ALCOSWITCH Switches; MPN: 1571983-3
U$1 = pixel:JTAGSWITCH
U$2 = pixel:RESONATOR
U$3 U$4 = pixel:SMD-JUMPER
X1 = pixel:MINI-USB-SHIELD-: MINI USB Connector Source: http://www.hirose.co.jp/cataloge_hp/e24000019.pdf; OC_FARNELL: unknown; OC_NEWARK: unknown